# Altium schematic sheet ANT.SchDoc: SIM868 Development Board
size A4; SheetNumber: 4; SheetTotal: 14
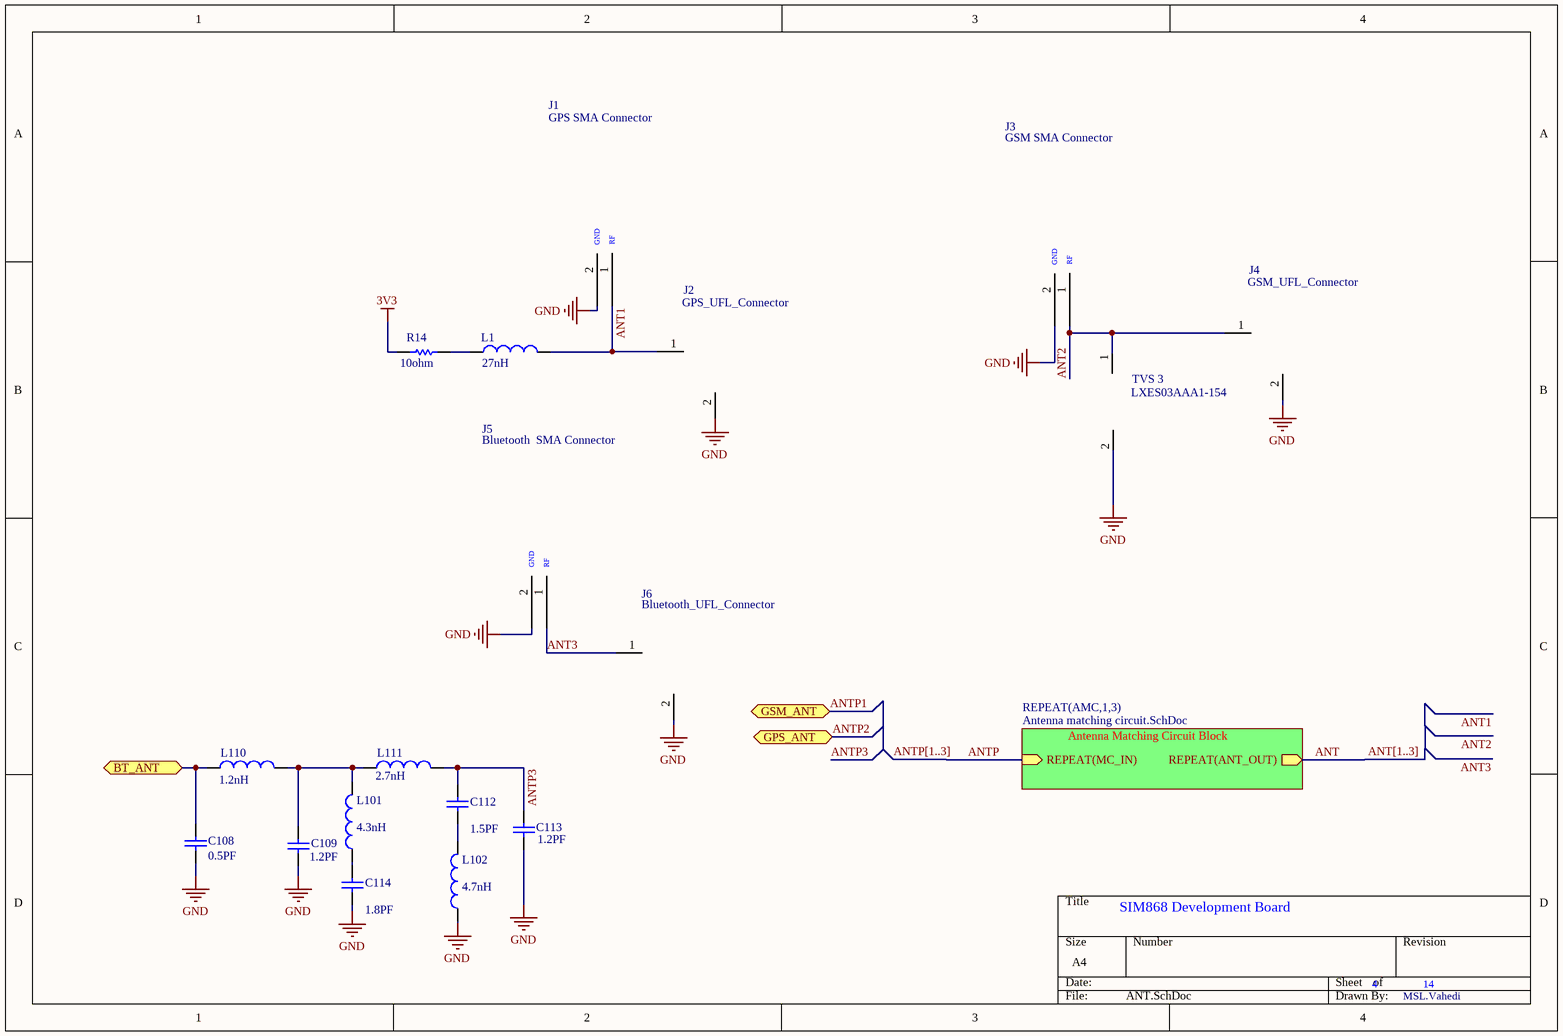
[diagram p0: ANT.SchDoc]

## Parts
C108  value 0.5PF  [RAD-0.3]
C109  value 1.2PF  [RAD-0.3]
C112  value 1.5PF  [RAD-0.3]
C113  value 1.2PF  [RAD-0.3]
C114  value 1.8PF  [RAD-0.3]
J1  GPS SMA Connector  [SMA right Angle]
J2  GPS_UFL_Connector  [UFL_Connector]
J3  GSM SMA Connector  [SMA right Angle]
J4  GSM_UFL_Connector  [UFL_Connector]
J5  Bluetooth  SMA Connector  [SMA right Angle]
J6  Bluetooth_UFL_Connector  [UFL_Connector]
L1  value 27nH  [INDC1608L]
L101  value 4.3nH  [0402-A]
L102  value 4.7nH  [0402-A]
L110  value 1.2nH  [0402-A]
L111  value 2.7nH  [0402-A]
R14  value 10ohm  [RES0805]
TVS_3  LXES03AAA1-154  [*FB_BLM18PG121SN1D]

## Sub-sheets
REPEAT(AMC,1,3) = Antenna matching circuit.SchDoc: REPEAT(ANT_OUT) (out), REPEAT(MC_IN) (in)

## Ports
BT_ANT (bidir), GPS_ANT (bidir), GSM_ANT (bidir)

## Nets
3V3: R14.1
GND: C108.1 C109.1 C113.1 C114.1 J1.2(GND) J2.2 J3.2(GND) J4.2 J5.2(GND) J6.2 L102.1 TVS_3.2
ANT: sheet REPEAT(AMC,1,3)/REPEAT(ANT_OUT)
ANT1: J1.1(RF) J2.1 L1.2
ANT2: J3.1(RF) J4.1 TVS_3.1
ANT3: J5.1(RF) J6.1
ANTP: sheet REPEAT(AMC,1,3)/REPEAT(MC_IN)
ANTP1: port GSM_ANT
ANTP2: port GPS_ANT
ANTP3: C112.2 C113.2 L111.2
BT_ANT: C108.2 L110.1 ; port BT_ANT
NetC109_2: C109.2 L101.2 L110.2 L111.1
NetC112_1: C112.1 L102.2
NetC114_2: C114.2 L101.1
NetL1_1: L1.1 R14.2

## Buses and harness runs
bus ANT[1..3]
bus ANTP[1..3]

## Notes on the sheet
- Antenna Matching Circuit Block
- MSL.Vahedi

## Library data of the parts
C108 C109 C112-C114 = Cap: Capacitor; Published: 8-Jun-2000; LatestRevisionDate: 17-Jul-2002; LatestRevisionNote: Re-released for DXP Platform.; PackageReference: RAD-0.3; Publisher: Altium Limited; PackageDescription: Radial Cap, Thru-Hole; 2 Leads; 0.3 in Pin Spacing
J1 J3 J5 = SMA Connector
J2 J4 J6 = UFL
L1 L101 L102 L110 L111 = Inductor: Code_IEC: 1005; Published: 8-Jun-2000; LatestRevisionDate: 29-May-2009; LatestRevisionNote: IPC-7351 Footprint Added.; PackageReference: 0402-A; Publisher: Altium Limited; PackageDescription: Chip Inductor; Code_JEITA: 0402
R14 = Res1: Resistor; Published: 8-Jun-2000; LatestRevisionDate: 17-Jul-2002; LatestRevisionNote: Re-released for DXP Platform.; PackageReference: AXIAL-0.3; Publisher: Altium Limited; PackageDescription: Axial Device, Thru-Hole; 2 Leads; 0.3 in Pin Spacing
TVS_3 = TVS: Recommended vendor  MURATA LXE03AAA1-154 || MURATA LXES015AAA1-154